# Altium schematic sheet TopLevel.SchDoc
size A
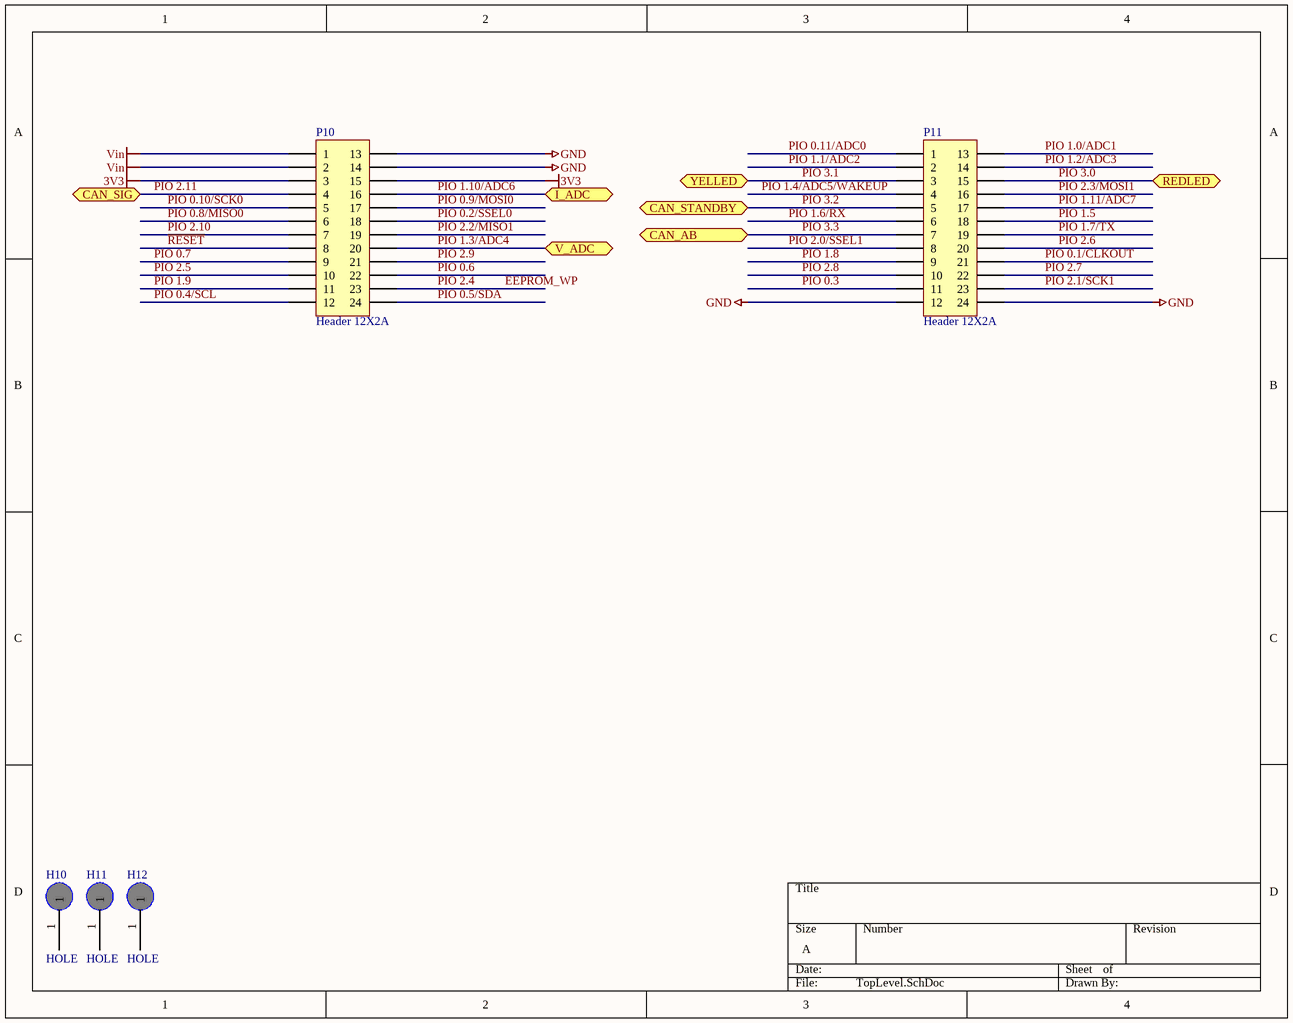
[diagram p0: TopLevel.SchDoc]

## Parts
H10  HOLE  [M2.5]
H11  HOLE  [M2.5]
H12  HOLE  [M2.5]
P10  Header 12X2A  [HDR2X12_CEN]
P11  Header 12X2A  [HDR2X12_CEN]

## Ports
CAN_AB, CAN_SIG, CAN_STANDBY, I_ADC, REDLED (bidir), V_ADC, YELLED (bidir)

## Nets
3V3: P10.3 P10.15
GND: P10.13 P10.14 P11.12 P11.24
Vin: P10.1 P10.2
EEPROM_WP: P10.23  [also labelled PIO 2.4]
PIO 0.1/CLKOUT: P11.21
PIO 0.2/SSEL0: P10.18
PIO 0.3: P11.11
PIO 0.4/SCL: P10.12
PIO 0.5/SDA: P10.24
PIO 0.6: P10.22
PIO 0.7: P10.9
PIO 0.8/MISO0: P10.6
PIO 0.9/MOSI0: P10.17
PIO 0.10/SCK0: P10.5
PIO 0.11/ADC0: P11.1
PIO 1.0/ADC1: P11.13
PIO 1.1/ADC2: P11.2
PIO 1.2/ADC3: P11.14
PIO 1.3/ADC4: P10.20 ; port V_ADC
PIO 1.4/ADC5/WAKEUP: P11.4
PIO 1.5: P11.18
PIO 1.6/RX: P11.6
PIO 1.7/TX: P11.19
PIO 1.8: P11.9
PIO 1.9: P10.11
PIO 1.10/ADC6: P10.16 ; port I_ADC
PIO 1.11/ADC7: P11.17
PIO 2.0/SSEL1: P11.8
PIO 2.1/SCK1: P11.23
PIO 2.2/MISO1: P10.19
PIO 2.3/MOSI1: P11.16
PIO 2.5: P10.10
PIO 2.6: P11.20
PIO 2.7: P11.22
PIO 2.8: P11.10
PIO 2.9: P10.21
PIO 2.10: P10.7
PIO 2.11: P10.4 ; port CAN_SIG
PIO 3.0: P11.15 ; port REDLED
PIO 3.1: P11.3 ; port YELLED
PIO 3.2: P11.5 ; port CAN_STANDBY
PIO 3.3: P11.7 ; port CAN_AB
~{RESET}: P10.8

Not connected (* = marked no-connect by the designer): H10 1; H11 1; H12 1

## Library data of the parts
H10-H12 = HOLE: Needed?: NO - Footprint
P10 P11 = Header 12X2A: Header, 12-Pin, Dual row; LatestRevisionDate: 17-Jul-2002; LatestRevisionNote: Re-released for DXP Platform.; Publisher: Altium Limited